# Altium schematic sheet InterfacesB_Decoupling.SchDoc
size A; DocumentNumber: 3; SheetNumber: 3
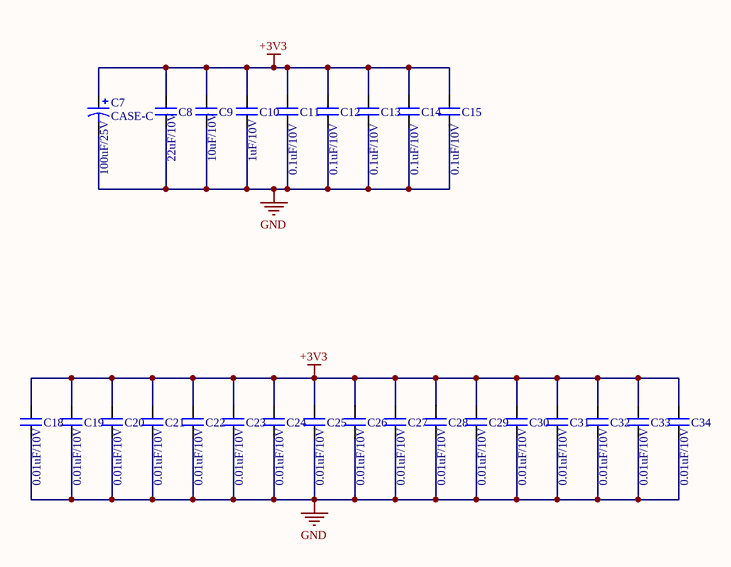
[diagram p0: InterfacesB_Decoupling.SchDoc]

## Parts
C7  CASE-C  value 100uF/25V  [CASE-C]
C8  value 22uF/10V  [CAP_0805]  (hidden comment: CAP_0805)
C9  value 10uF/10V  [CAP_0805]  (hidden comment: CAP_0805)
C10  value 1uF/10V  [CAP_0805]  (hidden comment: CAP_0805)
C11  value 0.1uF/10V  [CAP_0805]  (hidden comment: CAP_0805)
C12  value 0.1uF/10V  [CAP_0805]  (hidden comment: CAP_0805)
C13  value 0.1uF/10V  [CAP_0805]  (hidden comment: CAP_0805)
C14  value 0.1uF/10V  [CAP_0805]  (hidden comment: CAP_0805)
C15  value 0.1uF/10V  [CAP_0805]  (hidden comment: CAP_0805)
C18  value 0.01uF/10V  [CAP_0805]  (hidden comment: CAP_0805)
C19  value 0.01uF/10V  [CAP_0805]  (hidden comment: CAP_0805)
C20  value 0.01uF/10V  [CAP_0805]  (hidden comment: CAP_0805)
C21  value 0.01uF/10V  [CAP_0805]  (hidden comment: CAP_0805)
C22  value 0.01uF/10V  [CAP_0805]  (hidden comment: CAP_0805)
C23  value 0.01uF/10V  [CAP_0805]  (hidden comment: CAP_0805)
C24  value 0.01uF/10V  [CAP_0805]  (hidden comment: CAP_0805)
C25  value 0.01uF/10V  [CAP_0805]  (hidden comment: CAP_0805)
C26  value 0.01uF/10V  [CAP_0805]  (hidden comment: CAP_0805)
C27  value 0.01uF/10V  [CAP_0805]  (hidden comment: CAP_0805)
C28  value 0.01uF/10V  [CAP_0805]  (hidden comment: CAP_0805)
C29  value 0.01uF/10V  [CAP_0805]  (hidden comment: CAP_0805)
C30  value 0.01uF/10V  [CAP_0805]  (hidden comment: CAP_0805)
C31  value 0.01uF/10V  [CAP_0805]  (hidden comment: CAP_0805)
C32  value 0.01uF/10V  [CAP_0805]  (hidden comment: CAP_0805)
C33  value 0.01uF/10V  [CAP_0805]  (hidden comment: CAP_0805)
C34  value 0.01uF/10V  [CAP_0805]  (hidden comment: CAP_0805)

## Nets
+3V3: C7.A C8.2 C9.2 C10.2 C11.2 C12.2 C13.2 C14.2 C15.2 C18.2 C19.2 C20.2 C21.2 C22.2 C23.2 C24.2 C25.2 C26.2 C27.2 C28.2 C29.2 C30.2 C31.2 C32.2 C33.2 C34.2
GND: C7.K C8.1 C9.1 C10.1 C11.1 C12.1 C13.1 C14.1 C15.1 C18.1 C19.1 C20.1 C21.1 C22.1 C23.1 C24.1 C25.1 C26.1 C27.1 C28.1 C29.1 C30.1 C31.1 C32.1 C33.1 C34.1